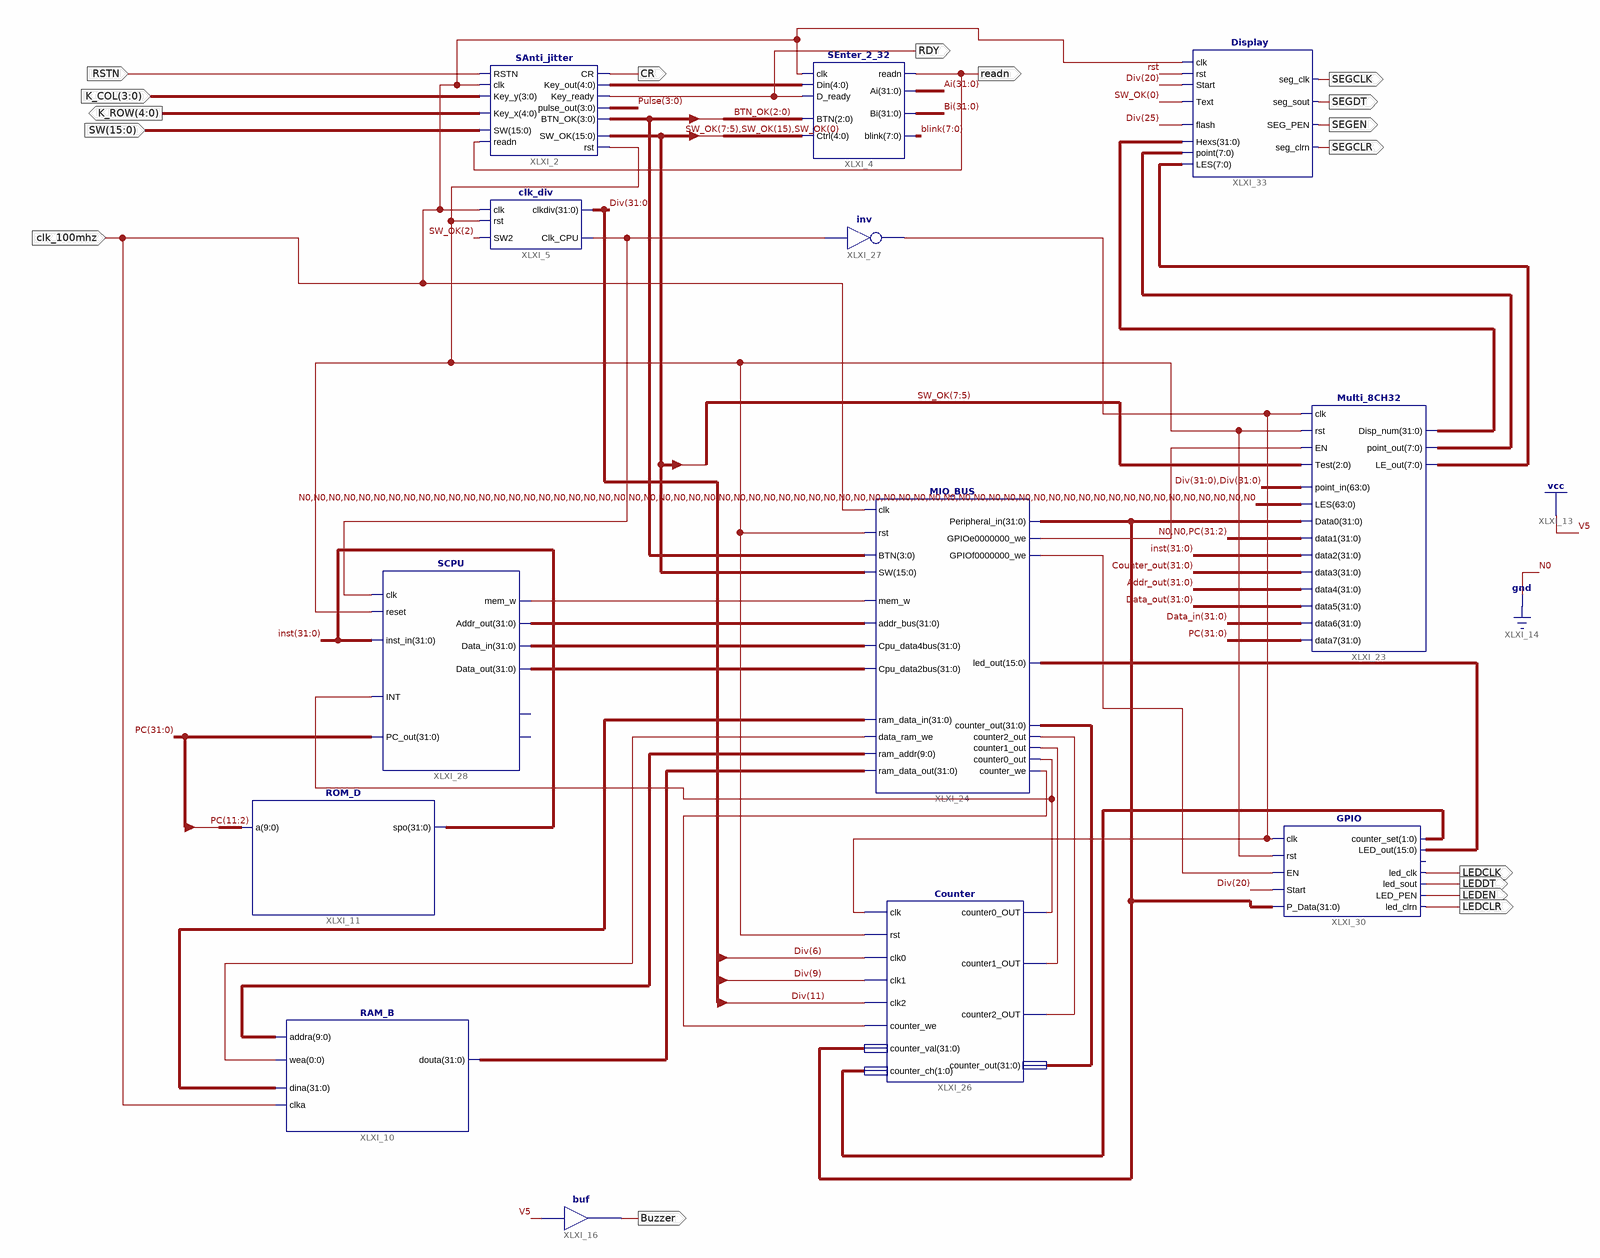
[diagram p0: schematic sheet 1]
// Xilinx ISE schematic TOP.sch (kintex7) as structural Verilog: 13 symbols, 17 ports
module TOP (
  input  RSTN,
  input  clk_100mhz,
  input  [3:0] K_COL,
  input  [15:0] SW,
  output CR,
  output RDY,
  output readn,
  output [4:0] K_ROW,
  output LEDCLK,
  output LEDDT,
  output LEDEN,
  output LEDCLR,
  output Buzzer,
  output SEGEN,
  output SEGDT,
  output SEGCLR,
  output SEGCLK
);

  wire Clk_CPU, GPIOF0, rst, XLXN_60, XLXN_68, XLXN_82, XLXN_83, XLXN_91, XLXN_97, XLXN_107;
  wire [0:0] XLXN_108;
  wire [1:0] XLXN_66;
  wire [3:0] BTN_OK, Pulse;
  wire [4:0] XLXN_4;
  wire [7:0] blink, LE_out, point_out;
  wire [9:0] XLXN_88;
  wire [15:0] SW_OK, XLXN_84;
  wire [31:0] Addr_out, Ai, Bi, Counter_out, CPU2IO, Data_in, Data_out, Disp_num, Div, inst, PC, XLXN_86,
       XLXN_90;

  SAnti_jitter XLXI_2 (
    .SW(SW), .readn(readn), .Key_y(K_COL), .Key_x(K_ROW), .RSTN(RSTN), .clk(clk_100mhz), .Key_out(XLXN_4),
    .Key_ready(RDY), .CR(CR), .rst(rst), .SW_OK(SW_OK), .pulse_out(Pulse), .BTN_OK(BTN_OK));
  SEnter_2_32 XLXI_4 (
    .readn(readn), .Ai(Ai), .Bi(Bi), .blink(blink), .Din(XLXN_4), .D_ready(RDY), .clk(clk_100mhz),
    .Ctrl({SW_OK[7:5], SW_OK[15], SW_OK[0]}), .BTN(BTN_OK[2:0]));
  clk_div XLXI_5 (.rst(rst), .clk(clk_100mhz), .SW2(SW_OK[2]), .clkdiv(Div), .Clk_CPU(Clk_CPU));
  Multi_8CH32 XLXI_23 (
    .Test(SW_OK[7:5]), .point_in({Div, Div}), .EN(XLXN_60), .clk(XLXN_107), .rst(rst), .LES({64{1'b0}}),
    .Data0(CPU2IO), .data1({2'b00, PC[31:2]}), .data2(inst), .data3(Counter_out), .data4(Addr_out),
    .data5(Data_out), .data6(Data_in), .data7(PC), .point_out(point_out), .LE_out(LE_out), .Disp_num(Disp_num));
  MIO_BUS XLXI_24 (
    .rst(rst), .clk(clk_100mhz), .mem_w(XLXN_91), .addr_bus(Addr_out), .Cpu_data4bus(Data_in),
    .Cpu_data2bus(Data_out), .ram_data_out(XLXN_86), .ram_addr(XLXN_88), .data_ram_we(XLXN_108[0]),
    .ram_data_in(XLXN_90), .counter_out(Counter_out), .counter2_out(XLXN_83), .counter1_out(XLXN_82),
    .counter0_out(XLXN_97), .counter_we(XLXN_68), .BTN(BTN_OK), .SW(SW_OK), .led_out(XLXN_84),
    .Peripheral_in(CPU2IO), .GPIOe0000000_we(XLXN_60), .GPIOf0000000_we(GPIOF0));
  buf XLXI_16 (Buzzer, 1'b1);
  Counter XLXI_26 (
    .clk(XLXN_107), .rst(rst), .clk0(Div[6]), .clk1(Div[9]), .clk2(Div[11]), .counter_we(XLXN_68),
    .counter_val(CPU2IO), .counter_ch(XLXN_66), .counter0_OUT(XLXN_97), .counter1_OUT(XLXN_82),
    .counter2_OUT(XLXN_83), .counter_out(Counter_out));
  not XLXI_27 (XLXN_107, Clk_CPU);
  RAM_B XLXI_10 (.addra(XLXN_88), .clka(clk_100mhz), .wea(XLXN_108[0]), .dina(XLXN_90), .douta(XLXN_86));
  ROM_D XLXI_11 (.a(PC[11:2]), .spo(inst));
  SCPU XLXI_28 (
    .clk(Clk_CPU), .reset(rst), .inst_in(inst), .INT(XLXN_97), .Addr_out(Addr_out), .mem_w(XLXN_91),
    .Data_out(Data_out), .Data_in(Data_in), .PC_out(PC));  // open: CPU_MIO, MIO_ready
  GPIO XLXI_30 (
    .clk(XLXN_107), .P_Data(CPU2IO), .rst(rst), .EN(GPIOF0), .Start(Div[20]), .led_clk(LEDCLK),
    .LED_out(XLXN_84), .counter_set(XLXN_66), .led_clrn(LEDCLR), .LED_PEN(LEDEN), .led_sout(LEDDT));  // open: GPIOf0
  Display XLXI_33 (
    .LES(LE_out), .SEG_PEN(SEGEN), .seg_sout(SEGDT), .seg_clrn(SEGCLR), .point(point_out), .Hexs(Disp_num),
    .Text(SW_OK[0]), .flash(Div[25]), .seg_clk(SEGCLK), .clk(clk_100mhz), .rst(rst), .Start(Div[20]));
endmodule
